# EasyEDA schematic SCH_16b_ADC_DAC扩展板_2022-10-03.json

## Sheets
1 连接器: TITLE: Sheet_1; REV: 1.0; Date: 2022-09-30; Sheet: 1/1; Company: Your Company
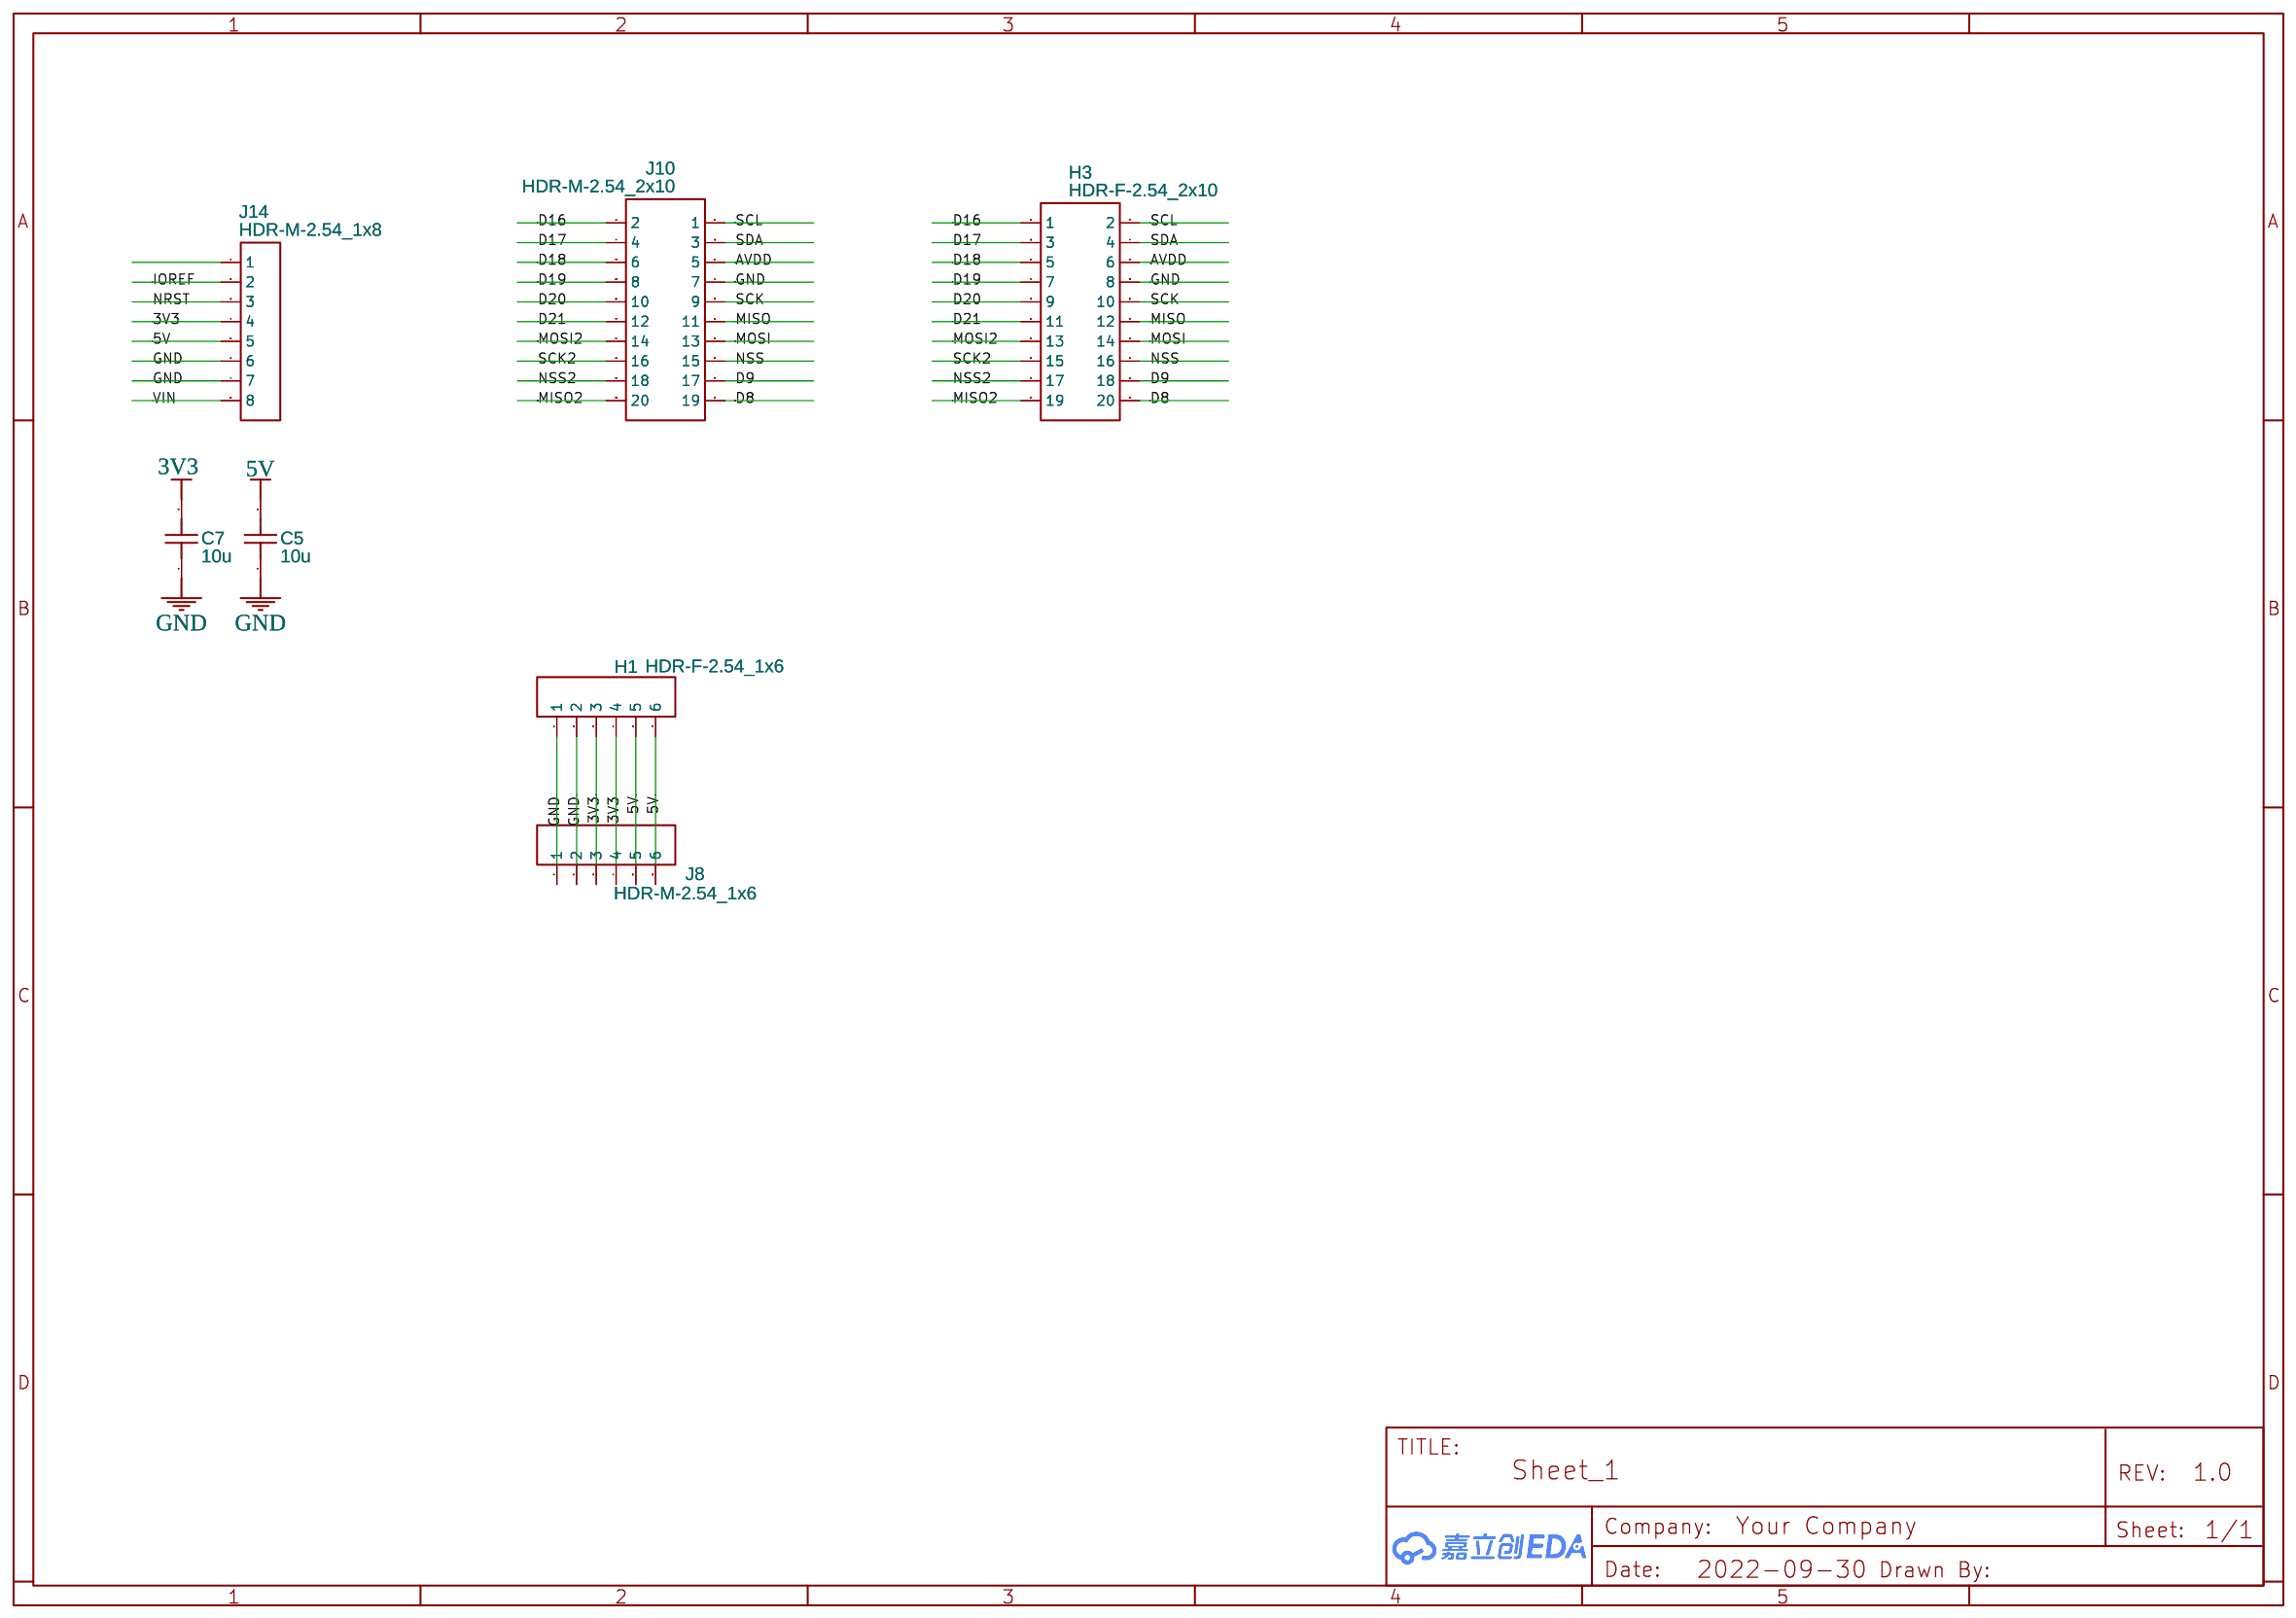
[diagram p0: 连接器]
2 电源: Date: 2022-09-03; Drawn By: minichao
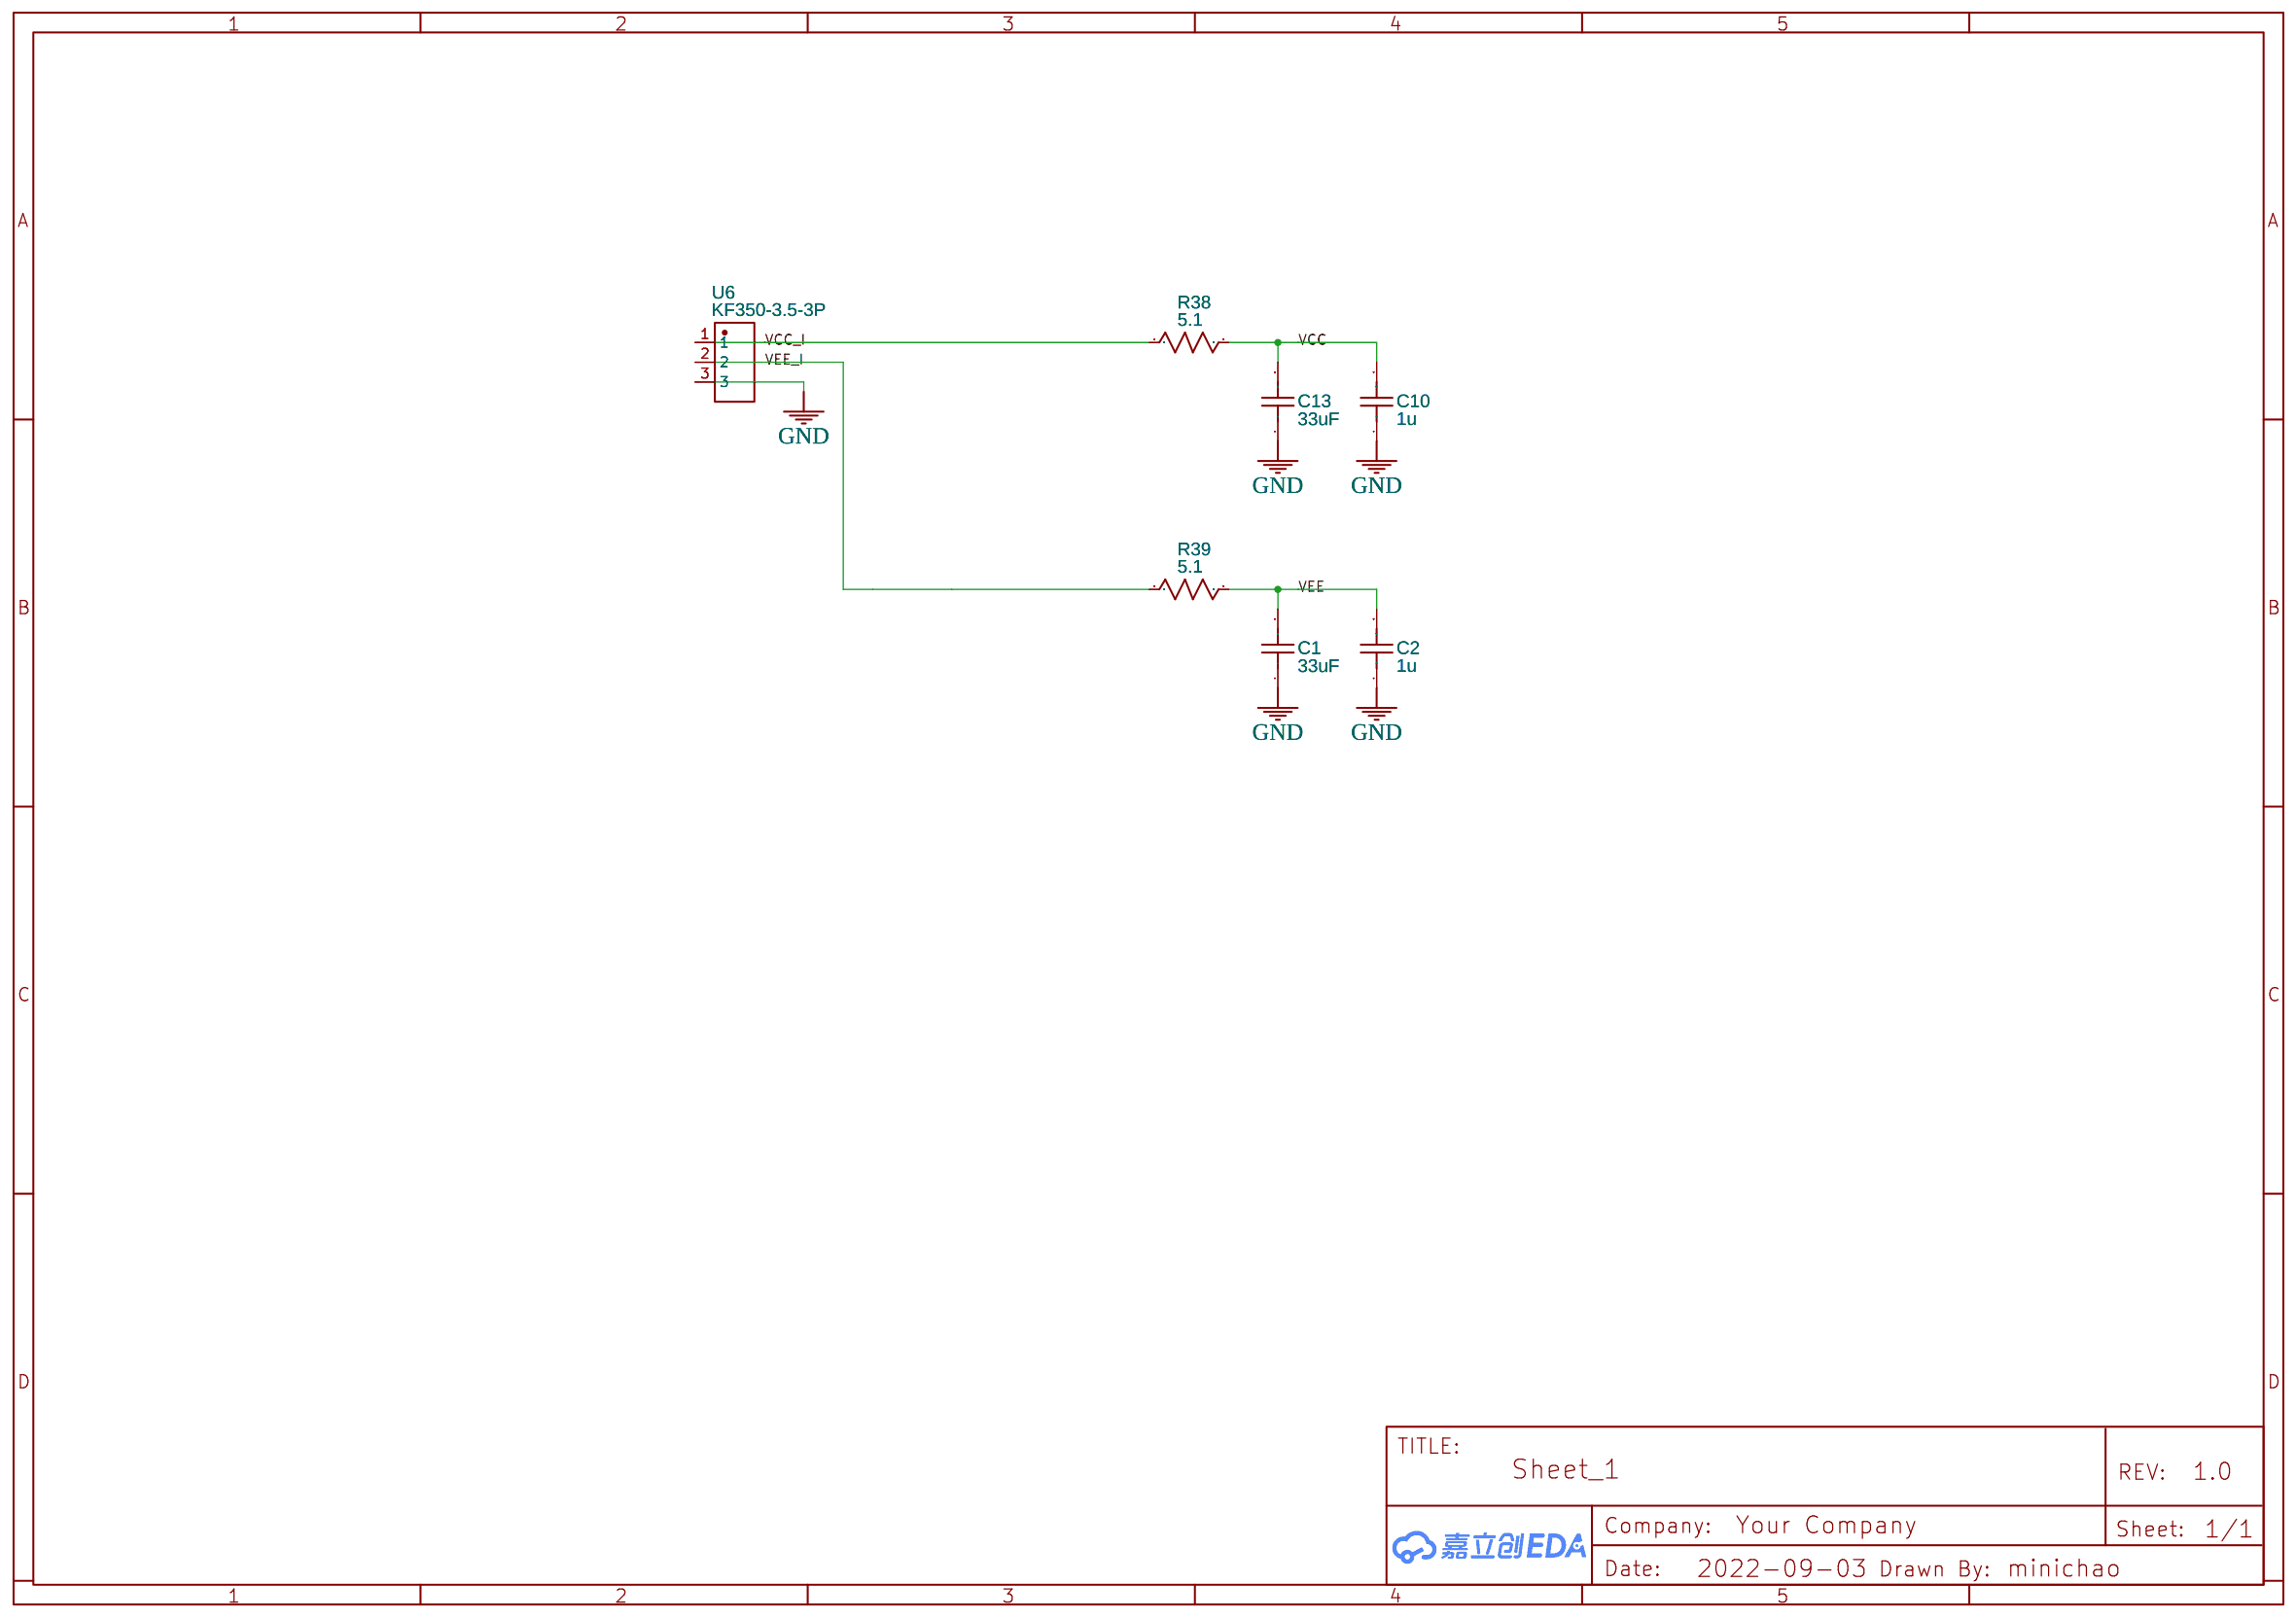
[diagram p1: 电源]
3 有源滤波器: TITLE: Sheet_2; Date: 2022-09-14
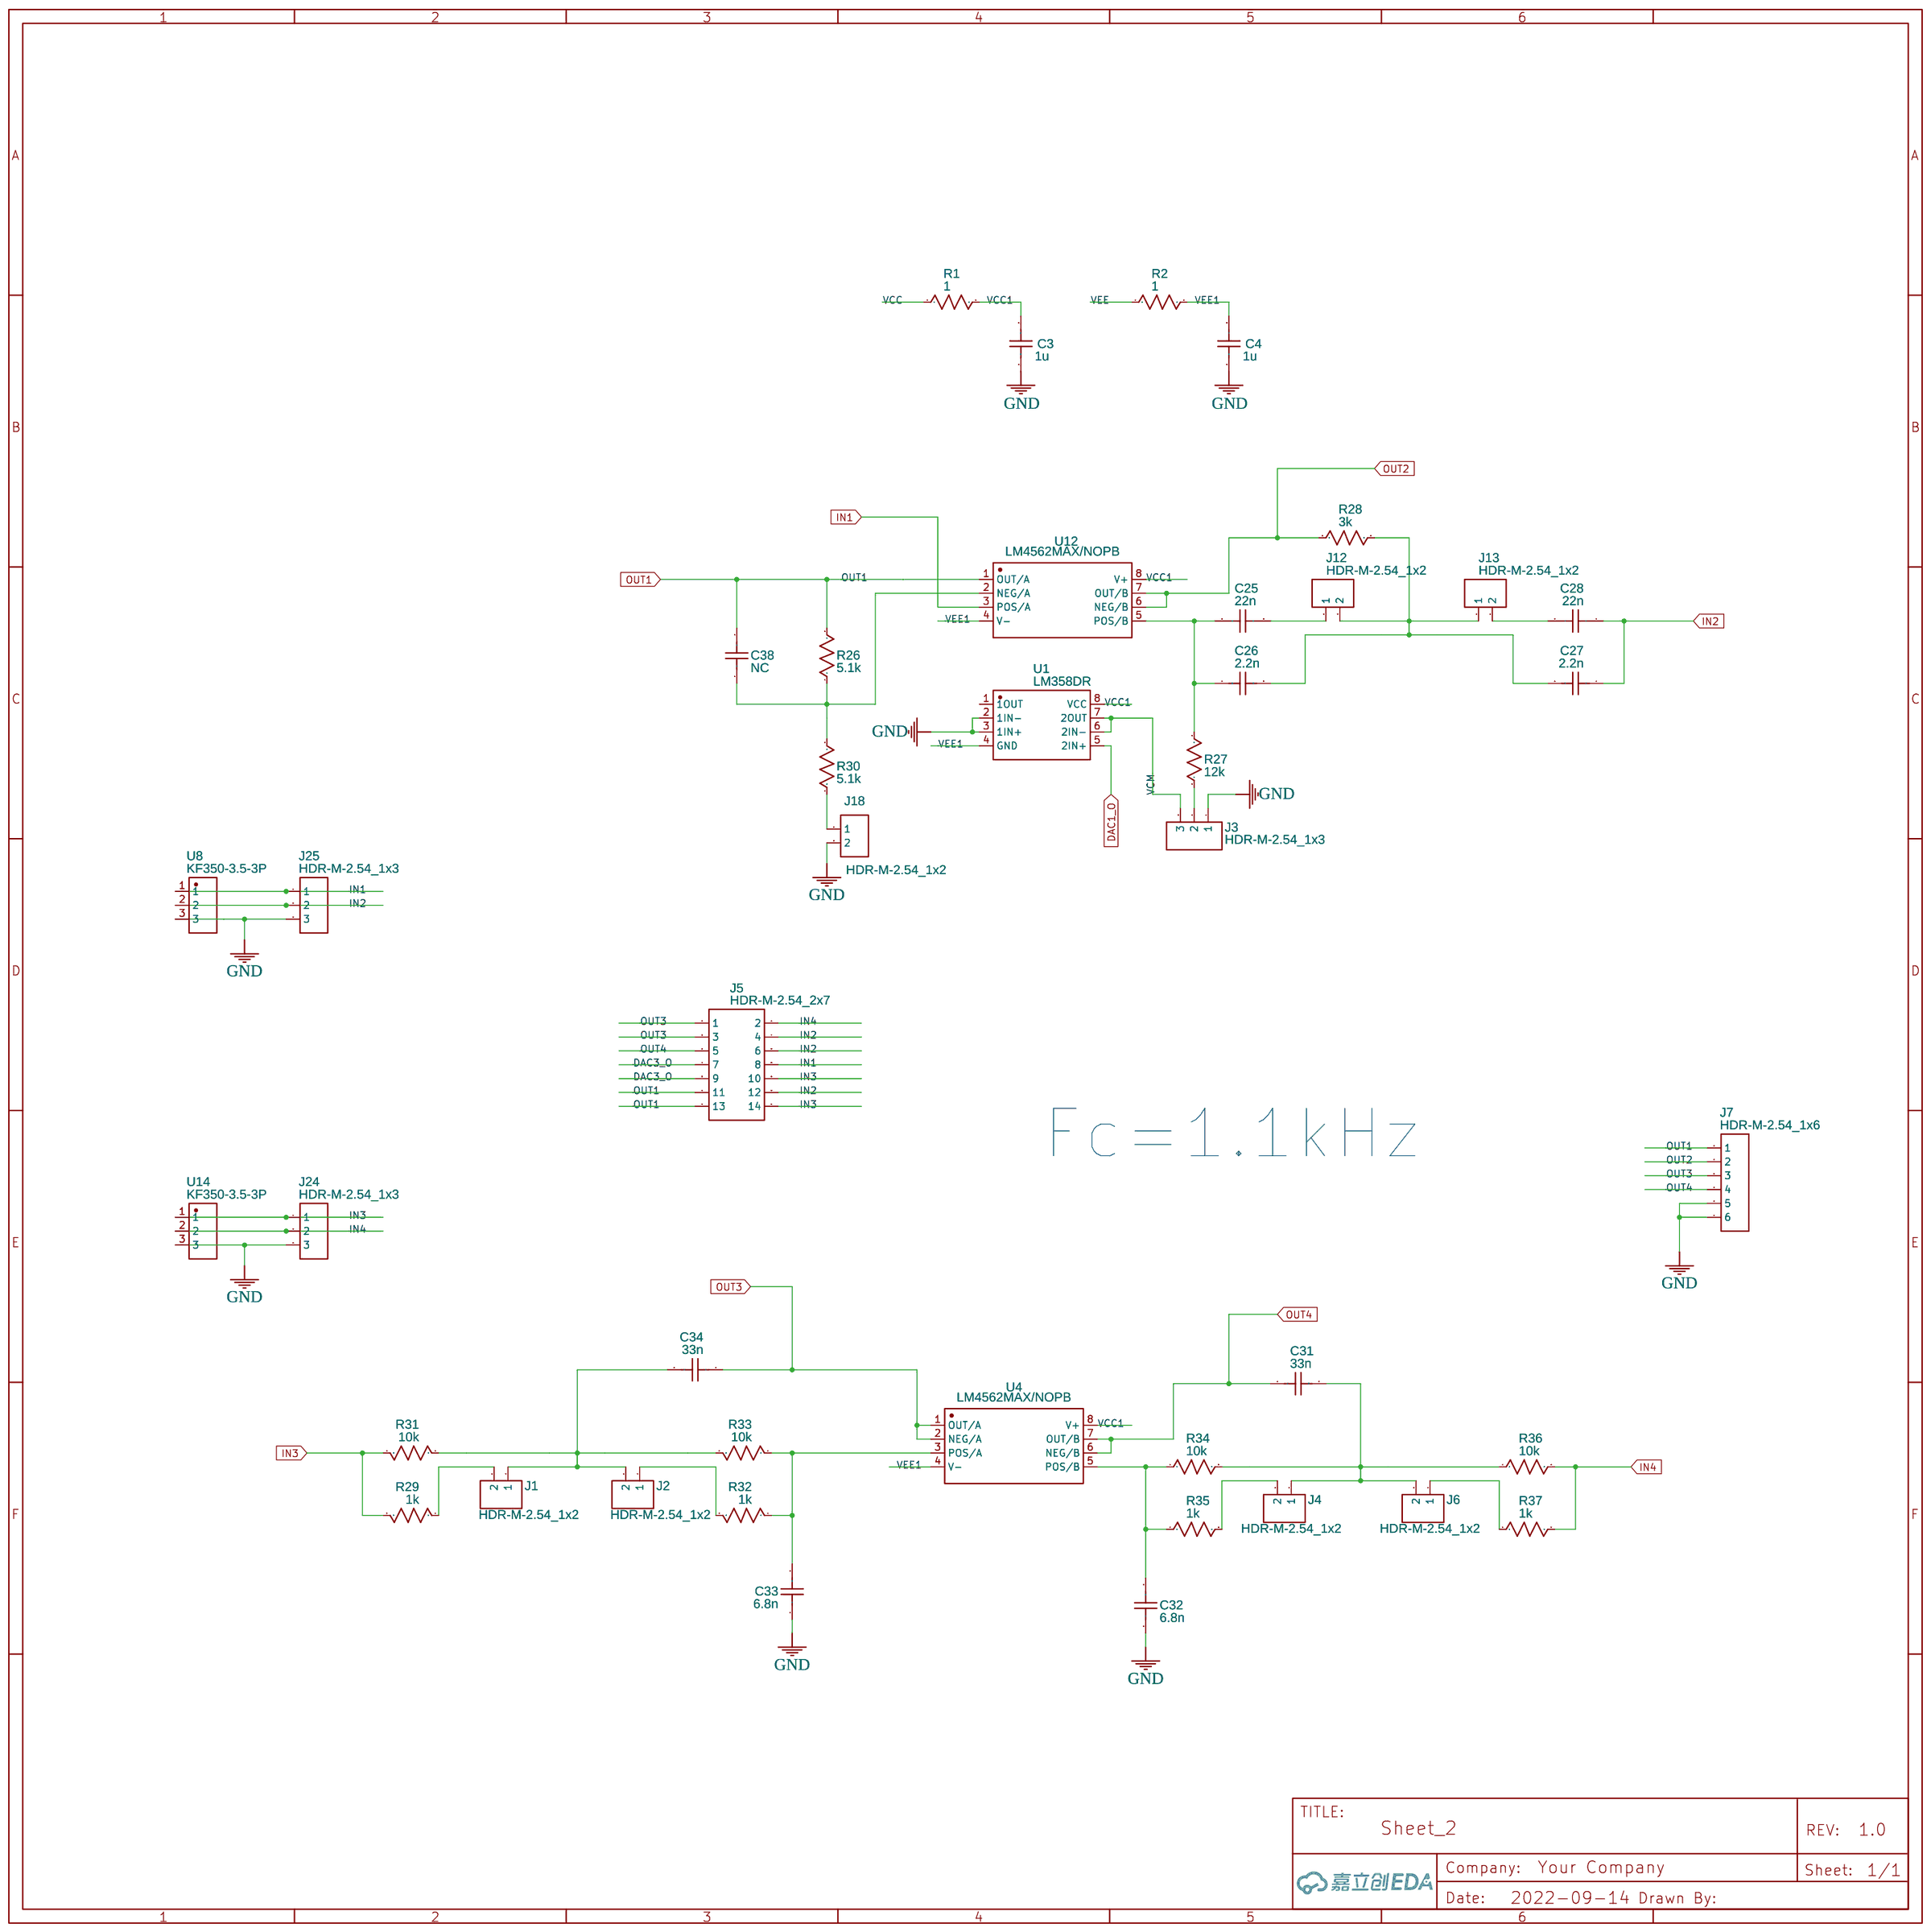
[diagram p2: 有源滤波器]
4 dac与逻辑电路: TITLE: Sheet_4; Date: 2022-09-15
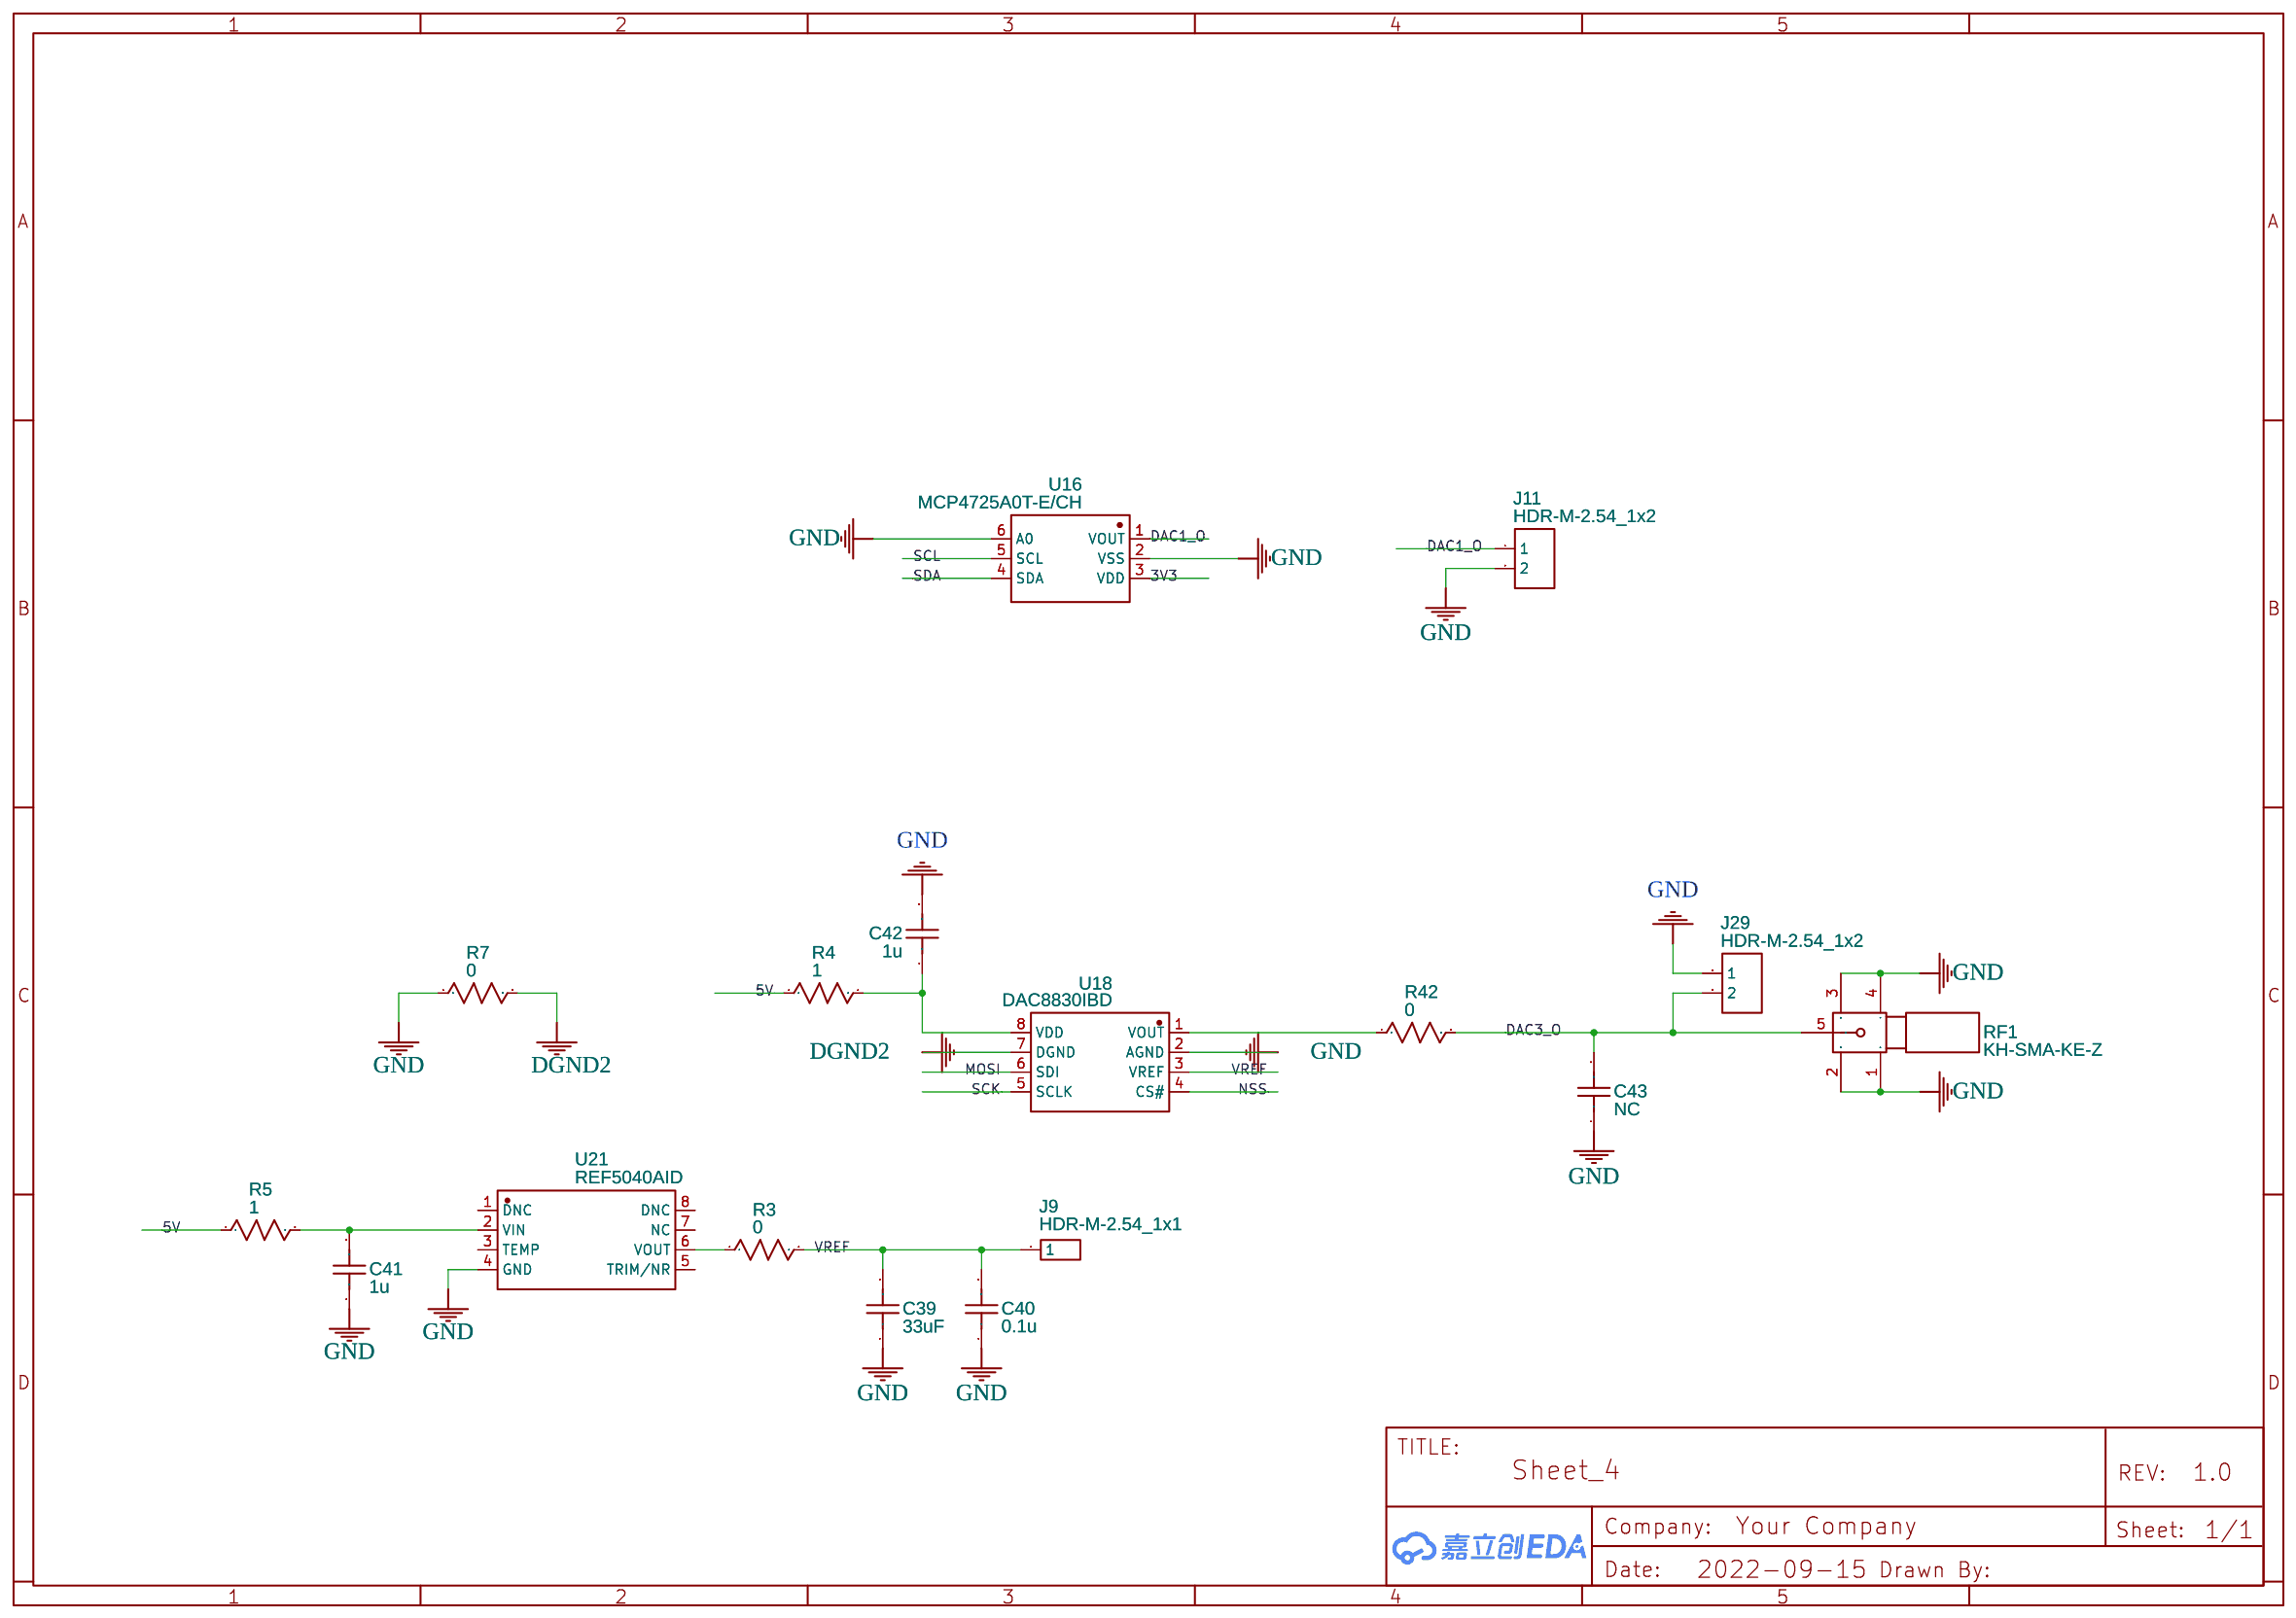
[diagram p3: dac与逻辑电路]
5 adc: TITLE: Sheet_5; Date: 2022-09-15
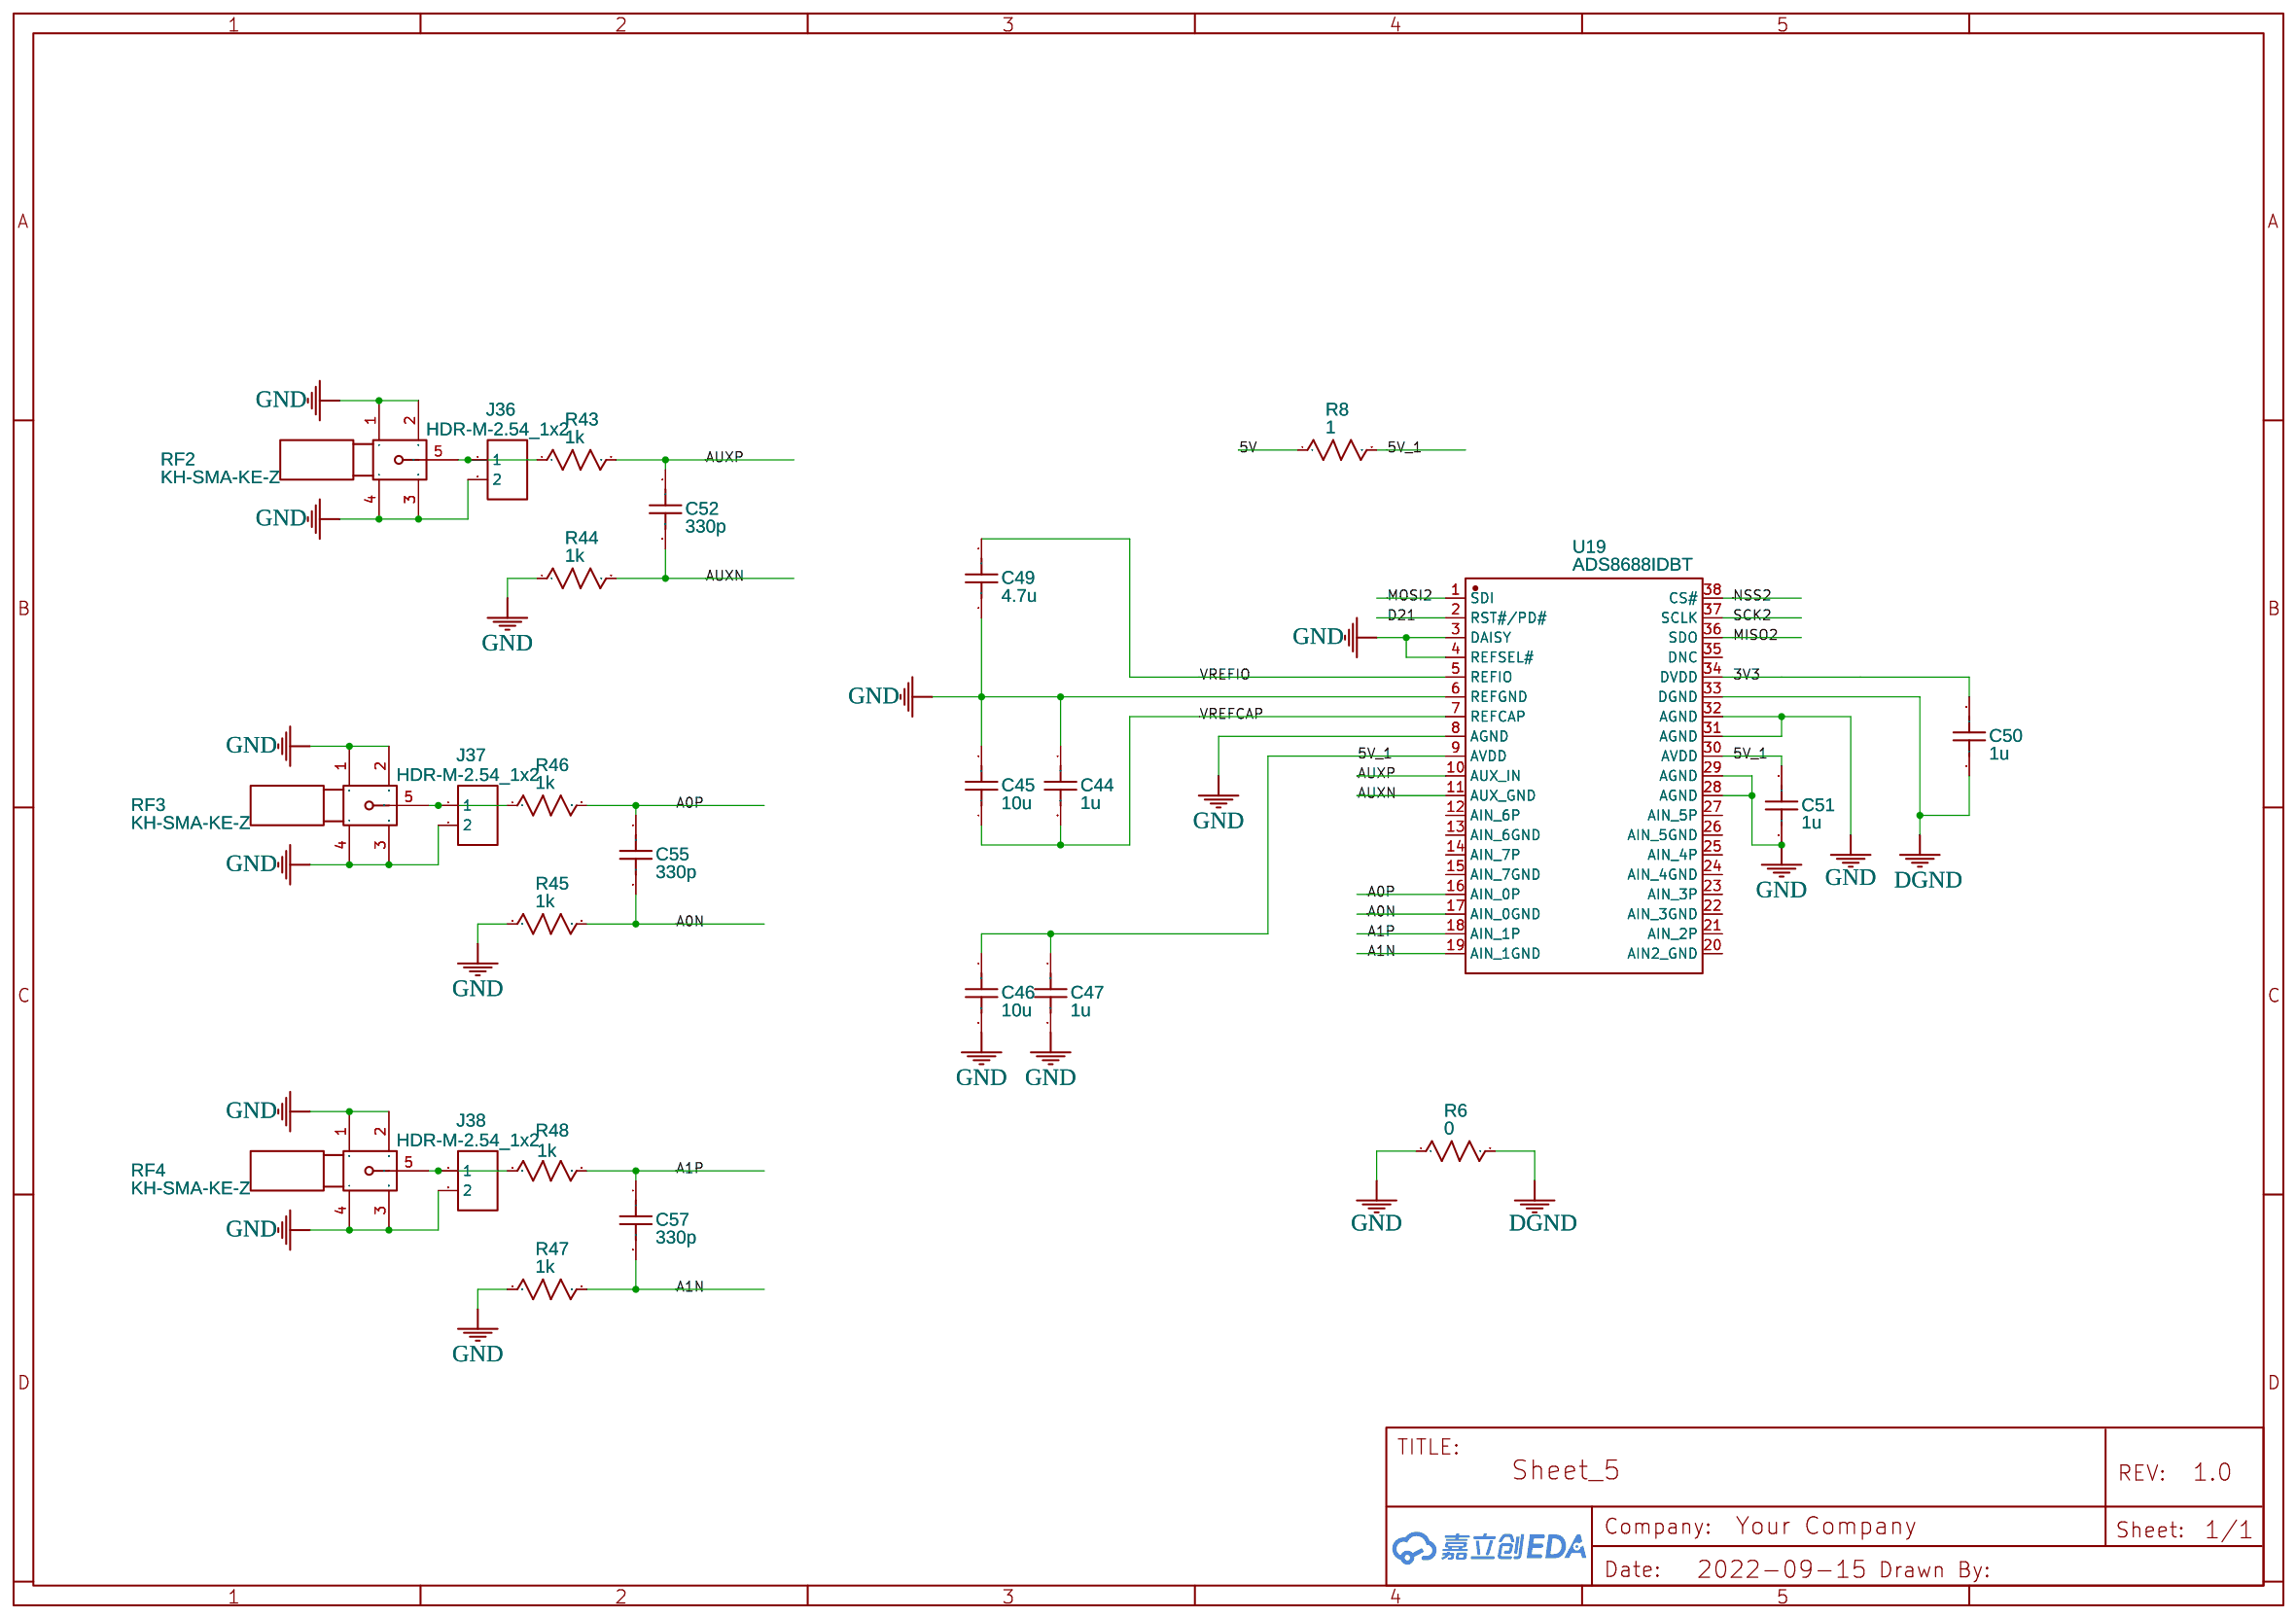
[diagram p4: adc]

## Parts
sheet adc
C44  1u  [C0805]
C45  10u  [C0805]
C46  10u  [C0805]
C47  1u  [C0805]
C49  4.7u  [C0805]
C50  1u  [C0805]
C51  1u  [C0805]
C52  330p  [C0805]
C55  330p  [C0805]
C57  330p  [C0805]
J36  HDR-M-2.54_1x2  [HDR-M-2.54_1X2]
J37  HDR-M-2.54_1x2  [HDR-M-2.54_1X2]
J38  HDR-M-2.54_1x2  [HDR-M-2.54_1X2]
R6  0  [R0805]
R8  1  [R0805]
R43  1k  [R0805]
R44  1k  [R0805]
R45  1k  [R0805]
R46  1k  [R0805]
R47  1k  [R0805]
R48  1k  [R0805]
RF2  KH-SMA-KE-Z  [SMA-TH_KH-SMA-KE-Z]
RF3  KH-SMA-KE-Z  [SMA-TH_KH-SMA-KE-Z]
RF4  KH-SMA-KE-Z  [SMA-TH_KH-SMA-KE-Z]
U19  ADS8688IDBT  [TSSOP-38_L9.7-W4.4-P0.50-LS6.4-BL]
sheet dac与逻辑电路
C39  33uF  [C1812]
C40  0.1u  [C0805]
C41  1u  [C0805]
C42  1u  [C0805]
C43  NC  [C0805]
J9  HDR-M-2.54_1x1  [HDR-M-2.54_1X1]
J11  HDR-M-2.54_1x2  [HDR-M-2.54_1X2]
J29  HDR-M-2.54_1x2  [HDR-M-2.54_1X2]
R3  0  [R0805]
R4  1  [R0805]
R5  1  [R0805]
R7  0  [R0805]
R42  0  [R0805]
RF1  KH-SMA-KE-Z  [SMA-TH_KH-SMA-KE-Z]
U16  MCP4725A0T-E/CH  [SOT-23-6_L2.9-W1.6-P0.95-LS2.8-BR]
U18  DAC8830IBD  [SOIC-8_L4.9-W3.9-P1.27-LS6.0-BL]
U21  REF5040AID  [SOIC-8_L4.9-W3.9-P1.27-LS6.0-BL]
sheet 有源滤波器
C3  1u  [C0805]
C4  1u  [C0805]
C25  22n  [C0805]
C26  2.2n  [C0805]
C27  2.2n  [C0805]
C28  22n  [C0805]
C31  33n  [C0805]
C32  6.8n  [C0805]
C33  6.8n  [C0805]
C34  33n  [C0805]
C38  NC  [C0805]
J1  HDR-M-2.54_1x2  [HDR-M-2.54_1X2]
J2  HDR-M-2.54_1x2  [HDR-M-2.54_1X2]
J3  HDR-M-2.54_1x3  [HDR-M-2.54_1X3]
J4  HDR-M-2.54_1x2  [HDR-M-2.54_1X2]
J5  HDR-M-2.54_2x7  [HDR-M-2.54_2X7]
J6  HDR-M-2.54_1x2  [HDR-M-2.54_1X2]
J7  HDR-M-2.54_1x6  [HDR-M-2.54_1X6]
J12  HDR-M-2.54_1x2  [HDR-M-2.54_1X2]
J13  HDR-M-2.54_1x2  [HDR-M-2.54_1X2]
J18  HDR-M-2.54_1x2  [HDR-M-2.54_1X2]
J24  HDR-M-2.54_1x3  [HDR-M-2.54_1X3]
J25  HDR-M-2.54_1x3  [HDR-M-2.54_1X3]
R1  1  [R0805]
R2  1  [R0805]
R26  5.1k  [R0805]
R27  12k  [R0805]
R28  3k  [R0805]
R29  1k  [R0805]
R30  5.1k  [R0805]
R31  10k  [R0805]
R32  1k  [R0805]
R33  10k  [R0805]
R34  10k  [R0805]
R35  1k  [R0805]
R36  10k  [R0805]
R37  1k  [R0805]
U1  LM358DR  [SOIC-8_L5.0-W4.0-P1.27-LS6.0-BL]
U4  LM4562MAX/NOPB  [SOIC-8_L5.0-W4.0-P1.27-LS6.0-BL]
U8  KF350-3.5-3P  [CONN-TH_3P-P3.50_KF350-3.5-3P]
U12  LM4562MAX/NOPB  [SOIC-8_L5.0-W4.0-P1.27-LS6.0-BL]
U14  KF350-3.5-3P  [CONN-TH_3P-P3.50_KF350-3.5-3P]
sheet 电源
C1  33uF  [C1812]
C2  1u  [C0805]
C10  1u  [C0805]
C13  33uF  [C1812]
R38  5.1  [R0805]
R39  5.1  [R0805]
U6  KF350-3.5-3P  [CONN-TH_3P-P3.50_KF350-3.5-3P]
sheet 连接器
C5  10u  [C0805]
C7  10u  [C0805]
H1  HDR-F-2.54_1x6  [HDR-F-2.54_1X6]
H3  HDR-F-2.54_2x10  [HDR-F-2.54_2X10]
J8  HDR-M-2.54_1x6  [HDR-M-2.54_1X6]
J10  HDR-M-2.54_2x10  [HDR-M-2.54_2X10]
J14  HDR-M-2.54_1x8  [HDR-M-2.54_1X8]

## Library data of the parts
C3 C4 C25-C28 C31-C34 C38 C40-C47 C49-C52 C55 C57 = C_0805_US: Contributor: LCEDA_Lib
J1 J2 J4 J6 J11-J13 J18 J29 J36-J38 = HDR-M-2.54_1x2: Supplier Part: C124375; Supplier: LCSC; Contributor: LCEDA_Lib
R1-R8 R26-R39 R42-R48 = R_0805_US: Contributor: LCEDA_Lib
RF1-RF4 = KH-SMA-KE-Z: Supplier: LCSC; Supplier Part: C504007; Manufacturer: Shenzhen Kinghelm Elec; Contributor: LCSC; JLCPCB Part Class: Extended Part
U19 = ADS8688IDBT: Supplier: LCSC; Supplier Part: C1542682; Manufacturer: TI(德州仪器); JLCPCB Part Class: Extended Part; Contributor: LCSC
C1 C13 C39 = C4532X5R1C336MT000N: Supplier: LCSC; Supplier Part: C338113; Manufacturer: TDK; Contributor: LCSC; JLCPCB Part Class: Extended Part
J9 = HDR-M-2.54_1x1: Supplier Part: C81276; Supplier: LCSC; Contributor: LCEDA_Lib
U16 = MCP4725A0T-E/CH: Supplier: LCSC; Manufacturer: MICROCHIP; Contributor: LCSC; Supplier Part: C144198; JLCPCB Part Class: Extended Part
U18 = DAC8830IBD: Supplier: LCSC; Supplier Part: C1554469; Manufacturer: TI(德州仪器); Contributor: LCSC
U21 = REF5040AID: Supplier: LCSC; Supplier Part: C1575304; Manufacturer: TI(德州仪器); link: https://atta.szlcsc.comnull; Contributor: LCSC
J3 J24 J25 = HDR-M-2.54_1x3: Supplier Part: C180248; Supplier: LCSC; Contributor: LCEDA_Lib
J5 = HDR-M-2.54_2x7: Supplier Part: C71397; Supplier: LCSC; Contributor: LCEDA_Lib
J7 J8 = HDR-M-2.54_1x6: Supplier Part: C190819; Supplier: LCSC; Contributor: LCEDA_Lib
U1 = LM358DR: tags: General Operational Amplifier; sourceId: LDdaKIigs; Supplier Part: C5423; Supplier: LCSC; SeeedStudio: 310020021; Manufacturer: TI; subpart_no: 1; JLCPCB Part Class: Extended Part
U4 U12 = LM4562MAX/NOPB: Supplier: LCSC; Manufacturer: TI; Supplier Part: C57367; JLCPCB Part Class: Extended Part
U6 U8 U14 = KF350-3.5-3P: Supplier: LCSC; Supplier Part: C474893; Manufacturer: Cixi Kefa Elec; Contributor: LCSC; JLCPCB Part Class: Extended Part
C2 C10 = C_0805_US: Supplier: LCSC; Contributor: LCEDA_Lib
C5 C7 = C_0805_US: Supplier Part: C2913555; Supplier: LCSC; Contributor: LCEDA_Lib; Manufacturer Part: 0805B105M500NT; Manufacturer: FH(风华)
H1 = HDR-F-2.54_1x6: Supplier Part: C40877; Supplier: LCSC; Contributor: LCEDA_Lib
H3 = HDR-F-2.54_2x10: Supplier Part: C30867; Supplier: LCSC; Contributor: LCEDA_Lib
J10 = HDR-M-2.54_2x10: Supplier Part: C124359; Supplier: LCSC; Contributor: LCEDA_Lib
J14 = HDR-M-2.54_1x8: Supplier Part: C190820; Supplier: LCSC; Contributor: LCEDA_Lib

## Nets
3V3: C7.2 C50.2 H1.3 H1.4 J8.3 J8.4 J14.4 U16.3(VDD) U19.34(DVDD)
5V: C5.2 H1.5 H1.6 J8.5 J8.6 J14.5 R4.1 R5.1 R8.1
5V_1: C46.1 C47.1 C51.2 R8.2 U19.9(AVDD) U19.30(AVDD)
AVDD: H3.6 J10.5
DGND: C50.1 R6.2 U19.33(DGND)
DGND2: R7.2 U18.7(DGND)
GND: C1.1 C2.1 C3.1 C4.1 C5.1 C7.1 C10.1 C13.1 C32.1 C33.1 C39.1 C40.1 C41.1 C42.2 C43.1 C44.1 C45.2 C46.2 C47.2 C49.1 C51.1 H1.1 H1.2 H3.8 J3.1 J7.5 J7.6 J8.1 J8.2 J10.7 J11.2 J14.6 J14.7 J18.2 J24.3 J25.3 J29.1 J36.2 J37.2 J38.2 R6.1 R7.1 R44.1 R45.1 R47.1 RF1.1 RF1.2 RF1.3 RF1.4 RF2.1 RF2.2 RF2.3 RF2.4 RF3.1 RF3.2 RF3.3 RF3.4 RF4.1 RF4.2 RF4.3 RF4.4 U1.2(1IN-) U1.3(1IN+) U6.3 U8.3 U14.3 U16.2(VSS) U16.6(A0) U18.2(AGND) U19.3(DAISY) U19.4(REFSEL#) U19.6(REFGND) U19.8(AGND) U19.28(AGND) U19.29(AGND) U19.31(AGND) U19.32(AGND) U21.4(GND)
VCC: C10.2 C13.2 R1.1 R38.2
VCC1: C3.2 R1.2 U1.8(VCC) U4.8(V+) U12.8(V+)
VCC_I: R38.1 U6.1
VEE: C1.2 C2.2 R2.1 R39.2
VEE1: C4.2 R2.2 U1.4(GND) U4.4(V-) U12.4(V-)
VEE_I: R39.1 U6.2
VIN: J14.8
A0N: C55.2 R45.2 U19.17(AIN_0GND)
A0P: C55.1 R46.2 U19.16(AIN_0P)
A1N: C57.2 R47.2 U19.19(AIN_1GND)
A1P: C57.1 R48.2 U19.18(AIN_1P)
AUXN: C52.2 R44.2 U19.11(AUX_GND)
AUXP: C52.1 R43.2 U19.10(AUX_IN)
D8: H3.20 J10.19
D9: H3.18 J10.17
D16: H3.1 J10.2
D17: H3.3 J10.4
D18: H3.5 J10.6
D19: H3.7 J10.8
D20: H3.9 J10.10
D21: H3.11 J10.12 U19.2(RST#/PD#)
DAC1_O: J11.1 U1.5(2IN+) U16.1(VOUT)
DAC3_O: C43.2 J5.7 J5.9 J29.2 R42.2 RF1.5
IN1: J5.8 J25.1 U8.1 U12.3(POS/A)
IN2: C27.1 C28.1 J5.4 J5.6 J5.12 J25.2 U8.2
IN3: J5.10 J5.14 J24.1 R29.2 R31.2 U14.1
IN4: J5.2 J24.2 R36.2 R37.2 U14.2
IOREF: J14.2
MISO: H3.12 J10.11
MISO2: H3.19 J10.20 U19.36(SDO)
MOSI: H3.14 J10.13 U18.6(SDI)
MOSI2: H3.13 J10.14 U19.1(SDI)
NRST: J14.3
NSS: H3.16 J10.15 U18.4(CS#)
NSS2: H3.17 J10.18 U19.38(CS#)
OUT1: C38.2 J5.11 J5.13 J7.1 R26.2 U12.1(OUT/A)
OUT2: J7.2 R28.1 U12.6(NEG/B) U12.7(OUT/B)
OUT3: C34.1 J5.1 J5.3 J7.3 U4.1(OUT/A) U4.2(NEG/A)
OUT4: C31.1 J5.5 J7.4 U4.6(NEG/B) U4.7(OUT/B)
SCK: H3.10 J10.9 U18.5(SCLK)
SCK2: H3.15 J10.16 U19.37(SCLK)
SCL: H3.2 J10.1 U16.5(SCL)
SDA: H3.4 J10.3 U16.4(SDA)
VCM: J3.3 U1.6(2IN-) U1.7(2OUT)
VREF: C39.2 C40.2 J9.1 R3.2 U18.3(VREF)
VREFCAP: C44.2 C45.1 U19.7(REFCAP)
VREFIO: C49.2 U19.5(REFIO)
Net-(C25-1): C25.1 C26.1 R27.2 U12.5(POS/B)
Net-(C25-2): C25.2 J12.1
Net-(C26-2): C26.2 C27.2 J12.2 J13.1 R28.2
Net-(C28-2): C28.2 J13.2
Net-(C31-2): C31.2 J4.1 J6.2 R34.2 R36.1
Net-(C32-2): C32.2 R34.1 R35.1 U4.5(POS/B)
Net-(C33-2): C33.2 R32.1 R33.1 U4.3(POS/A)
Net-(C34-2): C34.2 J1.1 J2.2 R31.1 R33.2
Net-(C38-1): C38.1 R26.1 R30.2 U12.2(NEG/A)
Net-(C41-2): C41.2 R5.2 U21.2(VIN)
Net-(C42-1): C42.1 R4.2 U18.8(VDD)
Net-(J1-2): J1.2 R29.1
Net-(J2-1): J2.1 R32.2
Net-(J3-2): J3.2 R27.1
Net-(J4-2): J4.2 R35.2
Net-(J6-1): J6.1 R37.1
Net-(J18-1): J18.1 R30.1
Net-(J36-1): J36.1 R43.1 RF2.5
Net-(J37-1): J37.1 R46.1 RF3.5
Net-(J38-1): J38.1 R48.1 RF4.5
Net-(R3-1): R3.1 U21.6(VOUT)
Net-(R42-1): R42.1 U18.1(VOUT)

Not connected (* = marked no-connect by the designer): J14 1; U1 1(1OUT); U19 12(AIN_6P) 13(AIN_6GND) 14(AIN_7P) 15(AIN_7GND) 20(AIN2_GND) 21(AIN_2P) 22(AIN_3GND) 23(AIN_3P) 24(AIN_4GND) 25(AIN_4P) 26(AIN_5GND) 27(AIN_5P) 35(DNC); U21 1(DNC) 3(TEMP) 5(TRIM/NR) 7(NC) 8(DNC)

## Notes on the sheets
sheet 3
- Fc=1.1kHz
